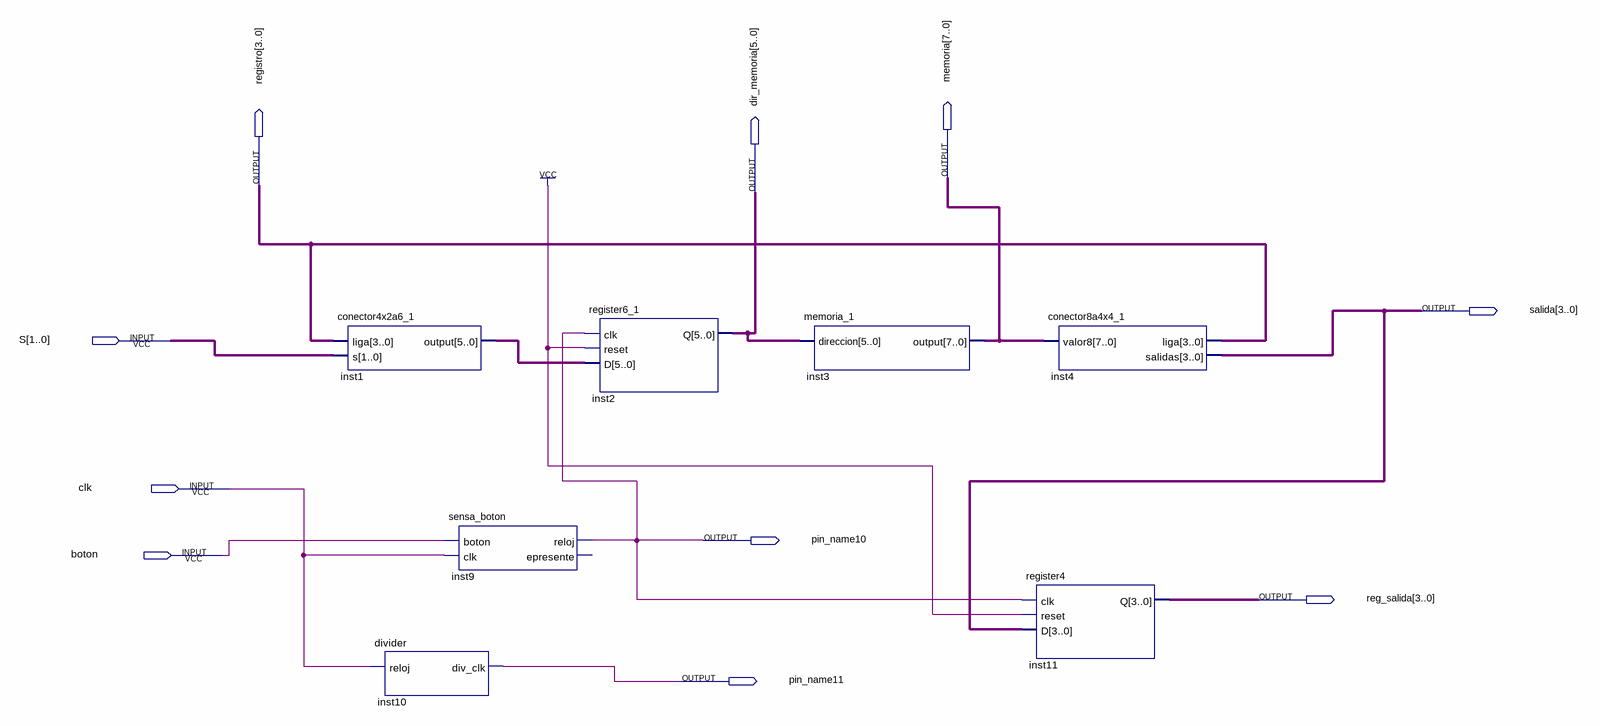
[diagram p0: schematic sheet]
// Quartus schematic Practica3.bdf as structural Verilog: 7 symbols, 10 pins
module Practica3 (
  input  [1:0] S,
  input  clk,
  input  boton,
  output [7:0] memoria,
  output [3:0] registro,
  output [5:0] dir_memoria,
  output [3:0] salida,
  output pin_name10,
  output [3:0] reg_salida,
  output pin_name11
);

  wire [5:0] inst1_output;

  conector4x2a6_1 inst1 (.liga(registro), .s(S), .\output (inst1_output));
  divider inst10 (.reloj(clk), .div_clk(pin_name11));
  sensa_boton inst9 (.boton(boton), .clk(clk), .reloj(pin_name10));  // open: epresente
  register6_1 inst2 (.clk(pin_name10), .reset(1'b1), .D(inst1_output), .Q(dir_memoria));
  memoria_1 inst3 (.direccion(dir_memoria), .\output (memoria));
  register4 inst11 (.clk(pin_name10), .reset(1'b1), .D(salida), .Q(reg_salida));
  conector8a4x4_1 inst4 (.valor8(memoria), .liga(registro), .salidas(salida));
endmodule
